# Altium schematic sheet 调偏电路.SchDoc
size A4
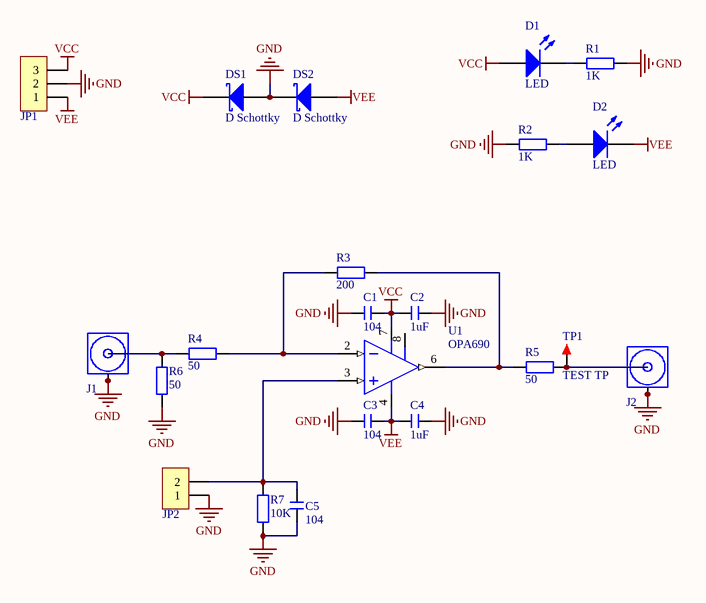
[diagram p0: 调偏电路.SchDoc]

## Parts
C1  104  [C 0603]
C2  1uF  [C 0603]
C3  104  [C 0603]
C4  1uF  [C 0603]
C5  104  [C 0603]
D1  LED  [LED_0805]
D2  LED  [LED_0805]
DS1  D Schottky  [DIODE-SMA]
DS2  D Schottky  [DIODE-SMA]
J1  COAX  [MCX5.08-5-H]  (value not drawn)
J2  COAX  [MCX5.08-5-H]  (value not drawn)
JP1  HDR-1X3  [XH2.54-3P_H]  (value not drawn)
JP2  HDR-1X2  [HDR-1X2]  (value not drawn)
R1  1K  [R 0805]
R2  1K  [R 0805]
R3  200  [R 0603]
R4  50  [R 0603]
R5  50  [R 0603]
R6  50  [R 0603]
R7  10K  [R 0603]
TP1  TEST TP  [TEST TP1.4_B]
U1  OPA690  [SOIC8_N]

## Nets
GND: C1.1 C2.2 C3.1 C4.2 C5.1 DS1.1 DS2.2 J1.2(GND) J1.3(GND) J1.4(GND) J1.5(GND) J2.2(GND) J2.3(GND) J2.4(GND) J2.5(GND) JP1.2 JP2.1 R1.2 R2.1 R6.1 R7.1
VCC: C1.2 C2.1 D1.1(A) DS1.2 JP1.3 U1.7(V+)
VEE: C3.2 C4.1 D2.2(K) DS2.1 JP1.1 U1.4(V-)
NetC5_2: C5.2 JP2.2 R7.2 U1.3(IN+)
NetD1_2: D1.2(K) R1.1
NetD2_1: D2.1(A) R2.2
NetJ1_1: J1.1(Signal) R4.1 R6.2
NetJ2_1: J2.1(Signal) R5.2 TP1.1
NetR3_1: R3.1 R4.2 U1.2(IN-)
NetR3_2: R3.2 R5.1 U1.6(OUT)

Not connected (* = marked no-connect by the designer): U1 8(DIS)

## Library data of the parts
C1-C5 = C: 无极性贴片电容; 版权归属: 源创客; BOM名称: 无极性贴片电容; 学习资源: www.ooocke.com
D1 D2 = LED: 发光二极管; Published: 8-Jun-2000; LatestRevisionDate: 08-Jul-2005; LatestRevisionNote: Mech Layer 1 removed.; PackageReference: LED; Publisher: Altium Limited
DS1 DS2 = D Schottky: Schottky Diode; Published: 8-Jun-2000; LatestRevisionDate: 17-Jul-2002; LatestRevisionNote: Re-released for DXP Platform.; PackageReference: SMB; Publisher: Altium Limited; PackageDescription: DO-214-AA/SMB; 2 C-Bend Leads; Body 5.3 x 3.6 mm, inc. leads (LxW); Code_JEDEC: DO-214-AA
JP1 = Header 3: 3P接插件; 版权归属: 源创客; BOM名称: 3P接插件; 学习资源: www.ooocke.com
JP2 = Header 2: 2P接插件; 版权归属: 源创客; BOM名称: 2P接插件; 学习资源: www.ooocke.com
R1-R7 = R: 贴片电阻; 版权归属: 源创客; BOM名称: 贴片电阻; 学习资源: www.ooocke.com
TP1 = TEST TP: 测试环; 版权归属: 源创客; BOM名称: 测试环; 学习资源: www.ooocke.com
U1 = OPA690ID: 具有禁用功能的宽带电压反馈运算放大器